# EAGLE schematic orbiphone (EAGLE 9.6.2)
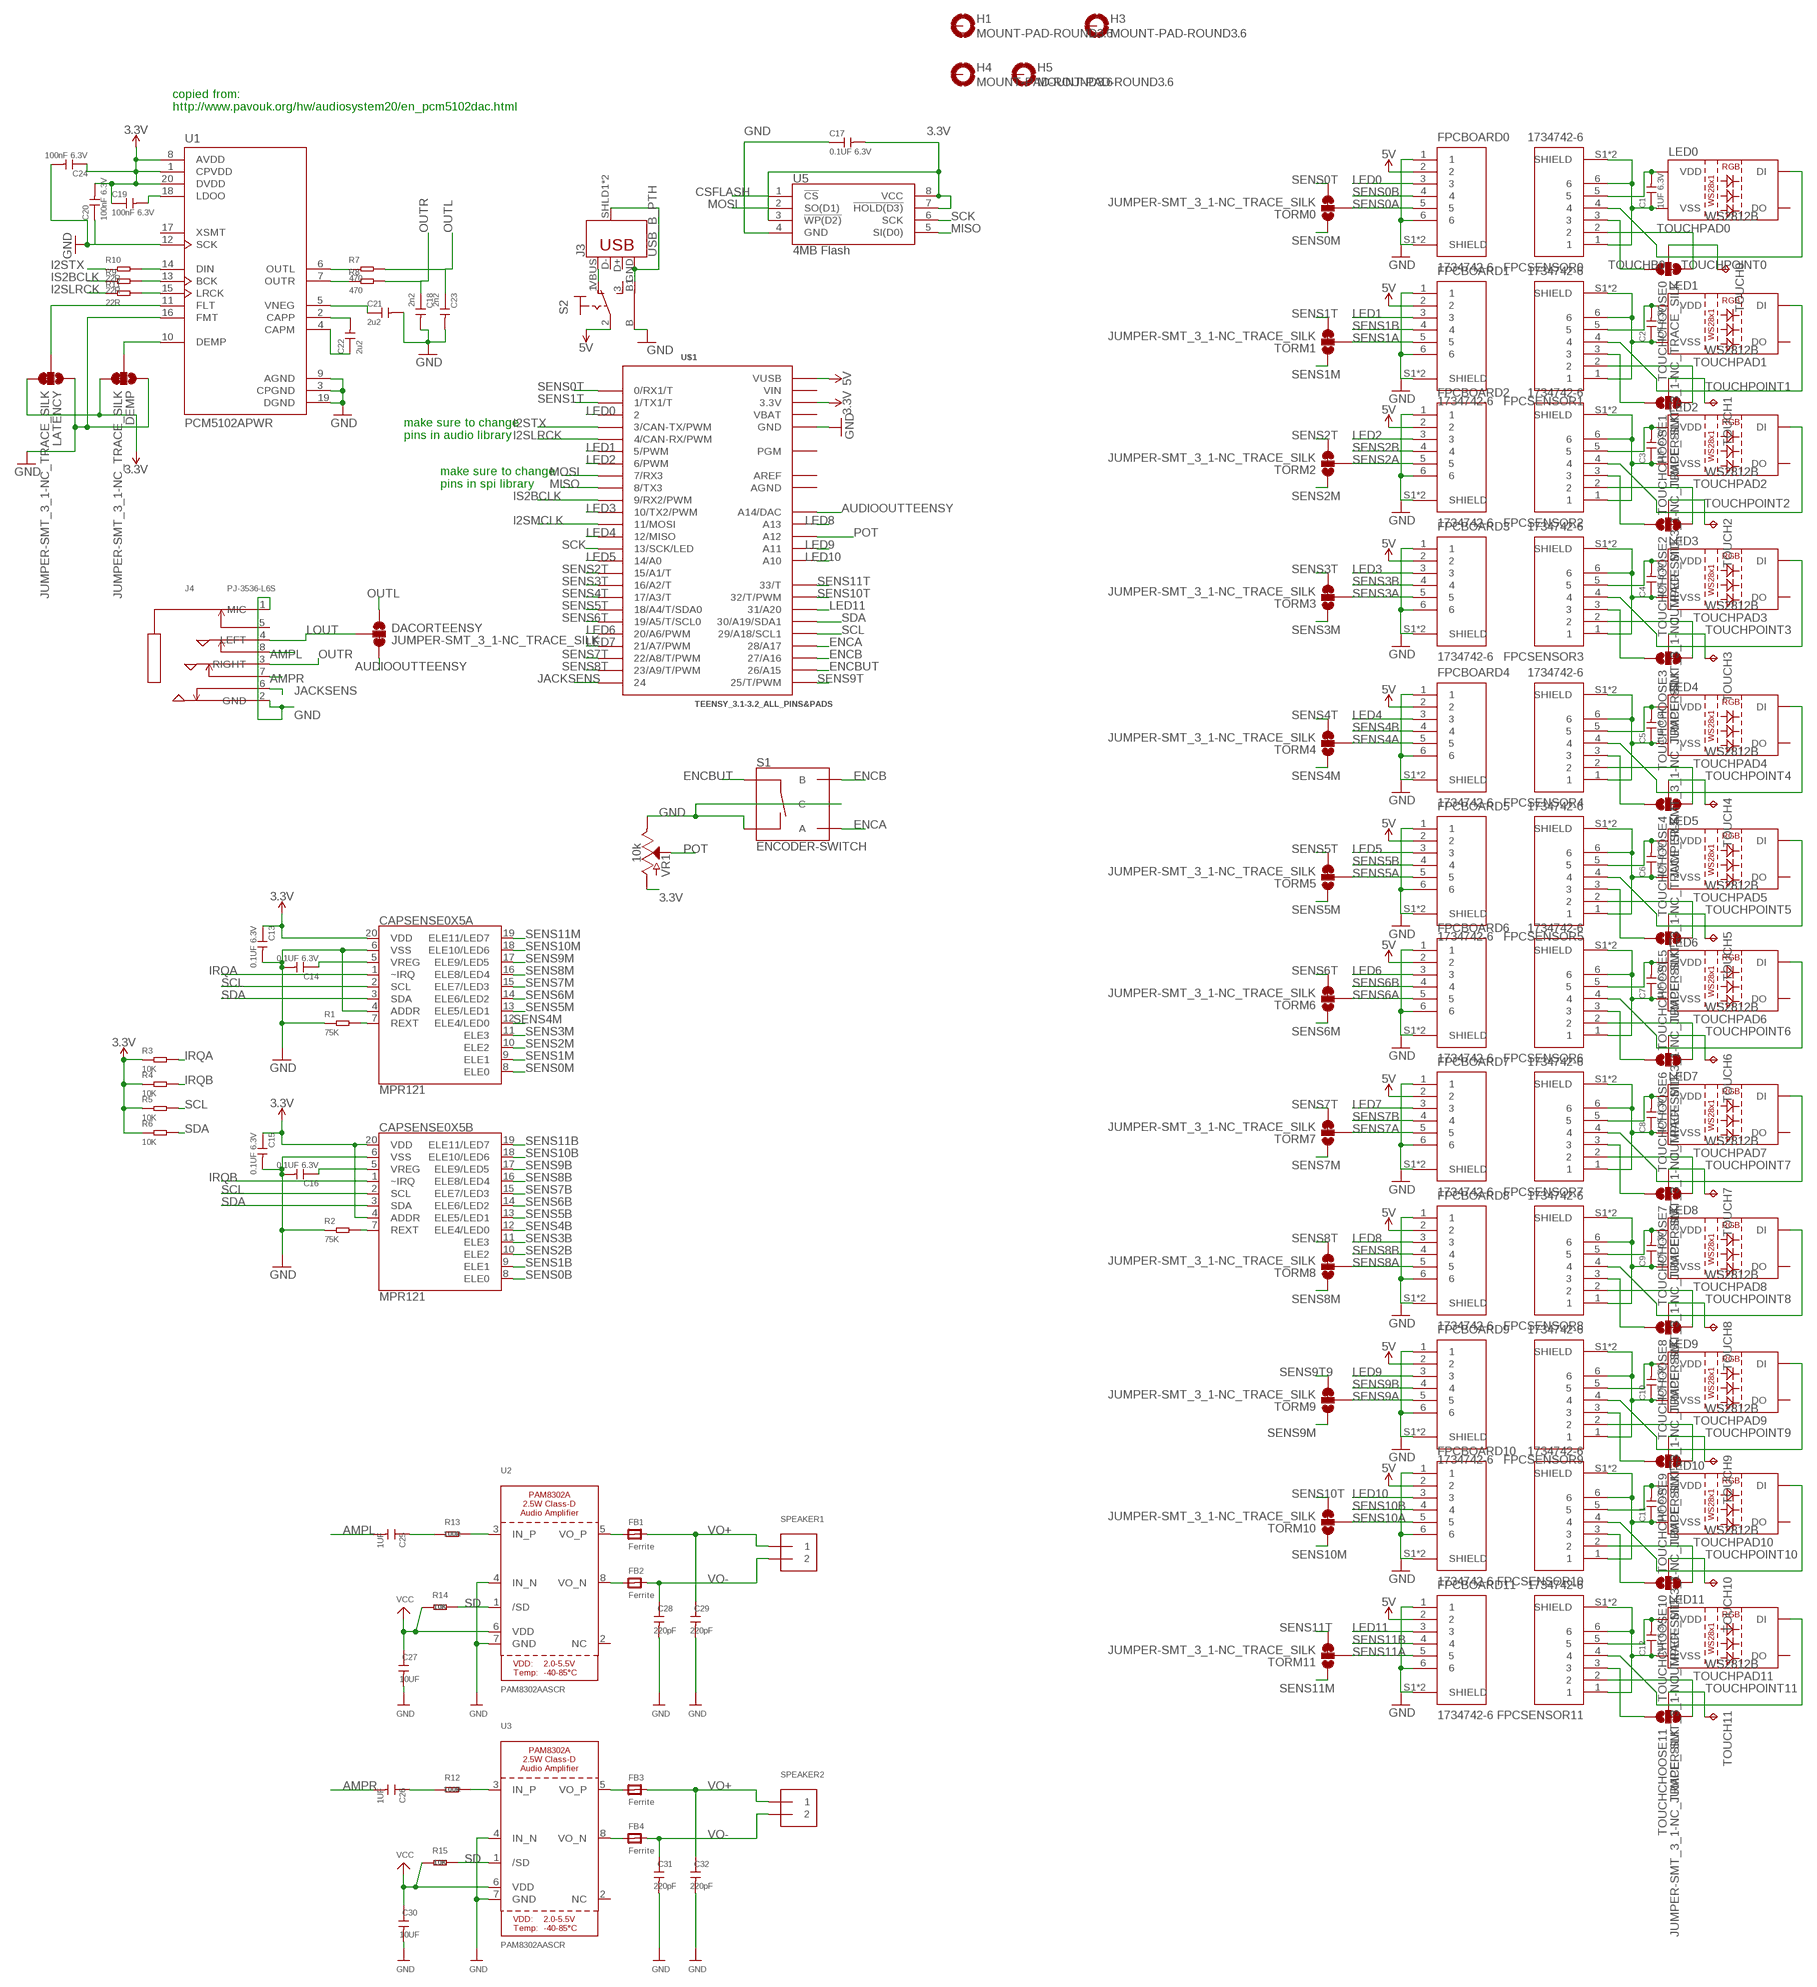
[diagram p0: schematic, sheet 1]

## Parts
C1  1UF 6.3V  CERAMIC-1UF-6.3V-10%-X5R(0402)  [C0402]
C2  1UF 6.3V  CERAMIC-1UF-6.3V-10%-X5R(0402)  [C0402]
C3  1UF 6.3V  CERAMIC-1UF-6.3V-10%-X5R(0402)  [C0402]
C4  1UF 6.3V  CERAMIC-1UF-6.3V-10%-X5R(0402)  [C0402]
C5  1UF 6.3V  CERAMIC-1UF-6.3V-10%-X5R(0402)  [C0402]
C6  1UF 6.3V  CERAMIC-1UF-6.3V-10%-X5R(0402)  [C0402]
C7  1UF 6.3V  CERAMIC-1UF-6.3V-10%-X5R(0402)  [C0402]
C8  1UF 6.3V  CERAMIC-1UF-6.3V-10%-X5R(0402)  [C0402]
C9  1UF 6.3V  CERAMIC-1UF-6.3V-10%-X5R(0402)  [C0402]
C10  1UF 6.3V  CERAMIC-1UF-6.3V-10%-X5R(0402)  [C0402]
C11  1UF 6.3V  CERAMIC-1UF-6.3V-10%-X5R(0402)  [C0402]
C12  1UF 6.3V  CERAMIC-1UF-6.3V-10%-X5R(0402)  [C0402]
C13  0.1UF 6.3V  CERAMIC-1UF-6.3V-10%-X5R(0402)  [C0402]
C14  0.1UF 6.3V  CERAMIC-1UF-6.3V-10%-X5R(0402)  [C0402]
C15  0.1UF 6.3V  CERAMIC-1UF-6.3V-10%-X5R(0402)  [C0402]
C16  0.1UF 6.3V  CERAMIC-1UF-6.3V-10%-X5R(0402)  [C0402]
C17  0.1UF 6.3V  CERAMIC-1UF-6.3V-10%-X5R(0402)  [C0402]
C18  2n2  CERAMIC-1UF-6.3V-10%-X5R(0402)  [C0402]
C19  100nF 6.3V  CERAMIC-1UF-6.3V-10%-X5R(0402)  [C0402]
C20  100nF 6.3V  CERAMIC-1UF-6.3V-10%-X5R(0402)  [C0402]
C21  2u2  CERAMIC-1UF-6.3V-10%-X5R(0402)  [C0402]
C22  2u2  CERAMIC-1UF-6.3V-10%-X5R(0402)  [C0402]
C23  2n2  CERAMIC-1UF-6.3V-10%-X5R(0402)  [C0402]
C24  100nF 6.3V  CERAMIC-1UF-6.3V-10%-X5R(0402)  [C0402]
C25  1UF  CERAMIC-1UF-6.3V-10%-X5R(0402)  [C0402]
C26  1UF  CERAMIC-1UF-6.3V-10%-X5R(0402)  [C0402]
C27  10UF  CERAMIC-1UF-6.3V-10%-X5R(0402)  [C0402]
C28  220pF  CERAMIC-1UF-6.3V-10%-X5R(0402)  [C0402]
C29  220pF  CERAMIC-1UF-6.3V-10%-X5R(0402)  [C0402]
C30  10UF  CERAMIC-1UF-6.3V-10%-X5R(0402)  [C0402]
C31  220pF  CERAMIC-1UF-6.3V-10%-X5R(0402)  [C0402]
C32  220pF  CERAMIC-1UF-6.3V-10%-X5R(0402)  [C0402]
CAPSENSE0X5A  MPR121  [QFN-20]
CAPSENSE0X5B  MPR121  [QFN-20]
DACORTEENSY  JUMPER-SMT_3_1-NC_TRACE_SILK  [SMT-JUMPER_3_1-NC_TRACE_SILK]
DEMP  JUMPER-SMT_3_1-NC_TRACE_SILK  [SMT-JUMPER_3_1-NC_TRACE_SILK]
FB1  Ferrite  FERRITE_0805  [_0805]
FB2  Ferrite  FERRITE_0805  [_0805]
FB3  Ferrite  FERRITE_0805  [_0805]
FB4  Ferrite  FERRITE_0805  [_0805]
FPCBOARD0  1734742-6  [TE_1734742-6]
FPCBOARD1  1734742-6  [TE_1734742-6]
FPCBOARD2  1734742-6  [TE_1734742-6]
FPCBOARD3  1734742-6  [TE_1734742-6]
FPCBOARD4  1734742-6  [TE_1734742-6]
FPCBOARD5  1734742-6  [TE_1734742-6]
FPCBOARD6  1734742-6  [TE_1734742-6]
FPCBOARD7  1734742-6  [TE_1734742-6]
FPCBOARD8  1734742-6  [TE_1734742-6]
FPCBOARD9  1734742-6  [TE_1734742-6]
FPCBOARD10  1734742-6  [TE_1734742-6]
FPCBOARD11  1734742-6  [TE_1734742-6]
FPCSENSOR0  1734742-6  [TE_1734742-6]
FPCSENSOR1  1734742-6  [TE_1734742-6]
FPCSENSOR2  1734742-6  [TE_1734742-6]
FPCSENSOR3  1734742-6  [TE_1734742-6]
FPCSENSOR4  1734742-6  [TE_1734742-6]
FPCSENSOR5  1734742-6  [TE_1734742-6]
FPCSENSOR6  1734742-6  [TE_1734742-6]
FPCSENSOR7  1734742-6  [TE_1734742-6]
FPCSENSOR8  1734742-6  [TE_1734742-6]
FPCSENSOR9  1734742-6  [TE_1734742-6]
FPCSENSOR10  1734742-6  [TE_1734742-6]
FPCSENSOR11  1734742-6  [TE_1734742-6]
H1  MOUNT-PAD-ROUND3.6  [3,6-PAD]
H3  MOUNT-PAD-ROUND3.6  [3,6-PAD]
H4  MOUNT-PAD-ROUND3.6  [3,6-PAD]
H5  MOUNT-PAD-ROUND3.6  [3,6-PAD]
J3  USB_B_PTH  [USB-B-PTH]
J4  PJ-3536-L6S  AUDIO-JACK-SMD-8P(PJ-3536-L6S)  [AUDIO8P-SMD-3.5-14.5X6X5MM]
LATENCY  JUMPER-SMT_3_1-NC_TRACE_SILK  [SMT-JUMPER_3_1-NC_TRACE_SILK]
LED0  WS2812B  [WS2812B]
LED1  WS2812B  [WS2812B]
LED2  WS2812B  [WS2812B]
LED3  WS2812B  [WS2812B]
LED4  WS2812B  [WS2812B]
LED5  WS2812B  [WS2812B]
LED6  WS2812B  [WS2812B]
LED7  WS2812B  [WS2812B]
LED8  WS2812B  [WS2812B]
LED9  WS2812B  [WS2812B]
LED10  WS2812B  [WS2812B]
LED11  WS2812B  [WS2812B]
R1  75K  SMD-RES-75K-1%-1/10W(0603)  [R0603]
R2  75K  SMD-RES-75K-1%-1/10W(0603)  [R0603]
R3  10K  SMD-RES-75K-1%-1/10W(0603)  [R0603]
R4  10K  SMD-RES-75K-1%-1/10W(0603)  [R0603]
R5  10K  SMD-RES-75K-1%-1/10W(0603)  [R0603]
R6  10K  SMD-RES-75K-1%-1/10W(0603)  [R0603]
R7  470  SMD-RES-75K-1%-1/10W(0603)  [R0603]
R8  470  SMD-RES-75K-1%-1/10W(0603)  [R0603]
R9  22R  SMD-RES-75K-1%-1/10W(0603)  [R0603]
R10  22R  SMD-RES-75K-1%-1/10W(0603)  [R0603]
R11  22R  SMD-RES-75K-1%-1/10W(0603)  [R0603]
R12  100R  SMD-RES-100R-1%-1/8W(0805)  [R0805]
R13  100R  SMD-RES-100R-1%-1/8W(0805)  [R0805]
R14  10K  SMD-RES-100R-1%-1/8W(0805)  [R0805]
R15  10K  SMD-RES-100R-1%-1/8W(0805)  [R0805]
S1  ENCODER-SWITCH  [ROTARY_ENC_PLAIN]
S2  316-917  [316-917]
SPEAKER1  TERMBLOCK_1X2  [TERMBLOCK_1X2-3.5MM]
SPEAKER2  TERMBLOCK_1X2  [TERMBLOCK_1X2-3.5MM]
TORM0  JUMPER-SMT_3_1-NC_TRACE_SILK  [SMT-JUMPER_3_1-NC_TRACE_SILK]
TORM1  JUMPER-SMT_3_1-NC_TRACE_SILK  [SMT-JUMPER_3_1-NC_TRACE_SILK]
TORM2  JUMPER-SMT_3_1-NC_TRACE_SILK  [SMT-JUMPER_3_1-NC_TRACE_SILK]
TORM3  JUMPER-SMT_3_1-NC_TRACE_SILK  [SMT-JUMPER_3_1-NC_TRACE_SILK]
TORM4  JUMPER-SMT_3_1-NC_TRACE_SILK  [SMT-JUMPER_3_1-NC_TRACE_SILK]
TORM5  JUMPER-SMT_3_1-NC_TRACE_SILK  [SMT-JUMPER_3_1-NC_TRACE_SILK]
TORM6  JUMPER-SMT_3_1-NC_TRACE_SILK  [SMT-JUMPER_3_1-NC_TRACE_SILK]
TORM7  JUMPER-SMT_3_1-NC_TRACE_SILK  [SMT-JUMPER_3_1-NC_TRACE_SILK]
TORM8  JUMPER-SMT_3_1-NC_TRACE_SILK  [SMT-JUMPER_3_1-NC_TRACE_SILK]
TORM9  JUMPER-SMT_3_1-NC_TRACE_SILK  [SMT-JUMPER_3_1-NC_TRACE_SILK]
TORM10  JUMPER-SMT_3_1-NC_TRACE_SILK  [SMT-JUMPER_3_1-NC_TRACE_SILK]
TORM11  JUMPER-SMT_3_1-NC_TRACE_SILK  [SMT-JUMPER_3_1-NC_TRACE_SILK]
TOUCH0  TPPAD1-13  [P1-13]
TOUCH1  TPPAD1-13  [P1-13]
TOUCH2  TPPAD1-13  [P1-13]
TOUCH3  TPPAD1-13  [P1-13]
TOUCH4  TPPAD1-13  [P1-13]
TOUCH5  TPPAD1-13  [P1-13]
TOUCH6  TPPAD1-13  [P1-13]
TOUCH7  TPPAD1-13  [P1-13]
TOUCH8  TPPAD1-13  [P1-13]
TOUCH9  TPPAD1-13  [P1-13]
TOUCH10  TPPAD1-13  [P1-13]
TOUCH11  TPPAD1-13  [P1-13]
TOUCHCHOOSE0  JUMPER-SMT_3_1-NC_TRACE_SILK  [SMT-JUMPER_3_1-NC_TRACE_SILK]
TOUCHCHOOSE1  JUMPER-SMT_3_1-NC_TRACE_SILK  [SMT-JUMPER_3_1-NC_TRACE_SILK]
TOUCHCHOOSE2  JUMPER-SMT_3_1-NC_TRACE_SILK  [SMT-JUMPER_3_1-NC_TRACE_SILK]
TOUCHCHOOSE3  JUMPER-SMT_3_1-NC_TRACE_SILK  [SMT-JUMPER_3_1-NC_TRACE_SILK]
TOUCHCHOOSE4  JUMPER-SMT_3_1-NC_TRACE_SILK  [SMT-JUMPER_3_1-NC_TRACE_SILK]
TOUCHCHOOSE5  JUMPER-SMT_3_1-NC_TRACE_SILK  [SMT-JUMPER_3_1-NC_TRACE_SILK]
TOUCHCHOOSE6  JUMPER-SMT_3_1-NC_TRACE_SILK  [SMT-JUMPER_3_1-NC_TRACE_SILK]
TOUCHCHOOSE7  JUMPER-SMT_3_1-NC_TRACE_SILK  [SMT-JUMPER_3_1-NC_TRACE_SILK]
TOUCHCHOOSE8  JUMPER-SMT_3_1-NC_TRACE_SILK  [SMT-JUMPER_3_1-NC_TRACE_SILK]
TOUCHCHOOSE9  JUMPER-SMT_3_1-NC_TRACE_SILK  [SMT-JUMPER_3_1-NC_TRACE_SILK]
TOUCHCHOOSE10  JUMPER-SMT_3_1-NC_TRACE_SILK  [SMT-JUMPER_3_1-NC_TRACE_SILK]
TOUCHCHOOSE11  JUMPER-SMT_3_1-NC_TRACE_SILK  [SMT-JUMPER_3_1-NC_TRACE_SILK]
U1  PCM5102APWR  [SOP65P640X120-20N]
U2  PAM8302AASCR  AUDIOAMP_PAM8302A  [MSOP8_0.65MM]
U3  PAM8302AASCR  AUDIOAMP_PAM8302A  [MSOP8_0.65MM]
U5  4MB Flash  AT25SF041  [SO08]
U$1  TEENSY_3.1-3.2_ALL_PINS&PADS  [TEENSY_3.0-3.2_ALL_PINS_&_PADS]
VR1  10k  POTENTIOMETER-PTH-9MM-1/20W-20%-KIT  [POT-PTH-ALPS-KIT]

## Nets
3.3V: C13.1 C15.1 C17.2 C19.1 C20.2 C24.1 CAPSENSE0X5A.20(VDD) CAPSENSE0X5B.4(ADDR) CAPSENSE0X5B.20(VDD) DEMP.3 LATENCY.3 R3.1 R4.1 R5.1 R6.1 U1.1(CPVDD) U1.8(AVDD) U1.20(DVDD) U5.3(!WP(D2)) U5.7(!HOLD(D3)) U5.8(VCC) U$1.3.3V U$1.3.3V1(3.3V) U$1.3.3V2(3.3V) VR1.P$3(A)
5V: FPCBOARD0.2 FPCBOARD1.2 FPCBOARD2.2 FPCBOARD3.2 FPCBOARD4.2 FPCBOARD5.2 FPCBOARD6.2 FPCBOARD7.2 FPCBOARD8.2 FPCBOARD9.2 FPCBOARD10.2 FPCBOARD11.2 S2.2(P) U$1.VUSB
AMPL: C25.2 J4.8
AMPR: C26.2 J4.7
AUDIOOUTTEENSY: DACORTEENSY.3 U$1.RESET/DAC(A14/DAC)
CSFLASH: U5.1(!CS)
ENCA: S1.A U$1.28(28/A17)
ENCB: S1.B U$1.27(27/A16)
ENCBUT: S1.SW+ U$1.26(26/A15)
GND: C13.2 C14.2 C15.2 C16.2 C17.1 C18.2 C20.1 C21.2 C23.2 C24.2 C27.2 C28.2 C29.2 C30.2 C31.2 C32.2 CAPSENSE0X5A.4(ADDR) CAPSENSE0X5A.6(VSS) CAPSENSE0X5B.6(VSS) DEMP.1 FPCBOARD0.1 FPCBOARD0.6 FPCBOARD0.S1(SHIELD) FPCBOARD0.S2(SHIELD) FPCBOARD1.1 FPCBOARD1.6 FPCBOARD1.S1(SHIELD) FPCBOARD1.S2(SHIELD) FPCBOARD2.1 FPCBOARD2.6 FPCBOARD2.S1(SHIELD) FPCBOARD2.S2(SHIELD) FPCBOARD3.1 FPCBOARD3.6 FPCBOARD3.S1(SHIELD) FPCBOARD3.S2(SHIELD) FPCBOARD4.1 FPCBOARD4.6 FPCBOARD4.S1(SHIELD) FPCBOARD4.S2(SHIELD) FPCBOARD5.1 FPCBOARD5.6 FPCBOARD5.S1(SHIELD) FPCBOARD5.S2(SHIELD) FPCBOARD6.1 FPCBOARD6.6 FPCBOARD6.S1(SHIELD) FPCBOARD6.S2(SHIELD) FPCBOARD7.1 FPCBOARD7.6 FPCBOARD7.S1(SHIELD) FPCBOARD7.S2(SHIELD) FPCBOARD8.1 FPCBOARD8.6 FPCBOARD8.S1(SHIELD) FPCBOARD8.S2(SHIELD) FPCBOARD9.1 FPCBOARD9.6 FPCBOARD9.S1(SHIELD) FPCBOARD9.S2(SHIELD) FPCBOARD10.1 FPCBOARD10.6 FPCBOARD10.S1(SHIELD) FPCBOARD10.S2(SHIELD) FPCBOARD11.1 FPCBOARD11.6 FPCBOARD11.S1(SHIELD) FPCBOARD11.S2(SHIELD) J4.1(MIC) J4.2(GND) LATENCY.1 R1.1 R2.1 S1.C S1.SW- S2.B U1.3(CPGND) U1.9(AGND) U1.12(SCK) U1.16(FMT) U1.19(DGND) U2.4(IN_N) U2.7(GND) U3.4(IN_N) U3.7(GND) U5.4(GND) U$1.GND U$1.GND1(GND) U$1.GND2(GND) VR1.P$1(E)
I2SLRCK: R11.1 U$1.4(4/CAN-RX/PWM)
I2SMCLK: U$1.11(11/MOSI)
I2STX: R10.1 U$1.3(3/CAN-TX/PWM)
IRQA: CAPSENSE0X5A.1(~IRQ) R3.2
IRQB: CAPSENSE0X5B.1(~IRQ) R4.2
IS2BCLK: R9.1 U$1.9(9/RX2/PWM)
JACKSENS: J4.6 U$1.24
LED0: FPCBOARD0.3 U$1.2
LED1: FPCBOARD1.3 U$1.5(5/PWM)
LED2: FPCBOARD2.3 U$1.6(6/PWM)
LED3: FPCBOARD3.3 U$1.10(10/TX2/PWM)
LED4: FPCBOARD4.3 U$1.12(12/MISO)
LED5: FPCBOARD5.3 U$1.14/A0
LED6: FPCBOARD6.3 U$1.20/A6(20/A6/PWM)
LED7: FPCBOARD7.3 U$1.21/A7(21/A7/PWM)
LED8: FPCBOARD8.3 U$1.A13
LED9: FPCBOARD9.3 U$1.A11
LED10: FPCBOARD10.3 U$1.A10
LED11: FPCBOARD11.3 U$1.31(31/A20)
LOUT: DACORTEENSY.2 J4.4(LEFT)
MISO: U5.5(SI(D0)) U$1.8(8/TX3)
MOSI: U5.2(SO(D1)) U$1.7(7/RX3)
N$1: C1.1 FPCSENSOR0.1 FPCSENSOR0.6 FPCSENSOR0.S1(SHIELD) FPCSENSOR0.S2(SHIELD) LED0.3(VSS)
N$2: C2.1 FPCSENSOR1.1 FPCSENSOR1.6 FPCSENSOR1.S1(SHIELD) FPCSENSOR1.S2(SHIELD) LED1.3(VSS)
N$3: C1.2 FPCSENSOR0.5 LED0.1(VDD)
N$4: FPCSENSOR0.4 LED0.4(DI)
N$5: C2.2 FPCSENSOR1.5 LED1.1(VDD)
N$6: FPCSENSOR1.4 LED1.4(DI)
N$9: FPCSENSOR1.3 TOUCHCHOOSE1.1
N$10: C3.1 FPCSENSOR2.1 FPCSENSOR2.6 FPCSENSOR2.S1(SHIELD) FPCSENSOR2.S2(SHIELD) LED2.3(VSS)
N$11: C3.2 FPCSENSOR2.5 LED2.1(VDD)
N$12: FPCSENSOR2.4 LED2.4(DI)
N$15: FPCSENSOR2.3 TOUCHCHOOSE2.1
N$16: C4.1 FPCSENSOR3.1 FPCSENSOR3.6 FPCSENSOR3.S1(SHIELD) FPCSENSOR3.S2(SHIELD) LED3.3(VSS)
N$17: C4.2 FPCSENSOR3.5 LED3.1(VDD)
N$18: FPCSENSOR3.4 LED3.4(DI)
N$21: FPCSENSOR3.3 TOUCHCHOOSE3.1
N$22: C5.1 FPCSENSOR4.1 FPCSENSOR4.6 FPCSENSOR4.S1(SHIELD) FPCSENSOR4.S2(SHIELD) LED4.3(VSS)
N$23: C5.2 FPCSENSOR4.5 LED4.1(VDD)
N$24: FPCSENSOR4.4 LED4.4(DI)
N$27: FPCSENSOR4.3 TOUCHCHOOSE4.1
N$28: C6.1 FPCSENSOR5.1 FPCSENSOR5.6 FPCSENSOR5.S1(SHIELD) FPCSENSOR5.S2(SHIELD) LED5.3(VSS)
N$29: C6.2 FPCSENSOR5.5 LED5.1(VDD)
N$30: FPCSENSOR5.4 LED5.4(DI)
N$33: FPCSENSOR5.3 TOUCHCHOOSE5.1
N$34: C7.1 FPCSENSOR6.1 FPCSENSOR6.6 FPCSENSOR6.S1(SHIELD) FPCSENSOR6.S2(SHIELD) LED6.3(VSS)
N$35: C7.2 FPCSENSOR6.5 LED6.1(VDD)
N$36: FPCSENSOR6.4 LED6.4(DI)
N$37: C14.1 CAPSENSE0X5A.5(VREG)
N$38: CAPSENSE0X5A.7(REXT) R1.2
N$42: J3.GND J3.SHLD1(SHIELD) J3.SHLD2(SHIELD) S2.B1
N$43: J3.VBUS S2.1(O)
N$53: C16.1 CAPSENSE0X5B.5(VREG)
N$54: CAPSENSE0X5B.7(REXT) R2.2
N$66: R10.2 U1.14(DIN)
N$67: R9.2 U1.13(BCK)
N$68: R11.2 U1.15(LRCK)
N$69: C19.2 U1.18(LDOO)
N$70: C22.2 U1.2(CAPP)
N$71: C22.1 U1.4(CAPM)
N$72: C21.1 U1.5(VNEG)
N$73: R7.1 U1.6(OUTL)
N$74: R8.1 U1.7(OUTR)
N$75: LATENCY.2 U1.11(FLT)
N$76: DEMP.2 U1.10(DEMP)
N$77: R12.2 U3.3(IN_P)
N$78: R13.2 U2.3(IN_P)
N$79: FB4.1 U3.8(VO_N)
N$80: FB2.1 U2.8(VO_N)
N$81: FB1.1 U2.5(VO_P)
N$82: C25.1 R13.1
N$83: FB3.1 U3.5(VO_P)
N$84: C26.1 R12.1
N$87: FPCSENSOR6.3 TOUCHCHOOSE6.1
N$88: C8.1 FPCSENSOR7.1 FPCSENSOR7.6 FPCSENSOR7.S1(SHIELD) FPCSENSOR7.S2(SHIELD) LED7.3(VSS)
N$89: C8.2 FPCSENSOR7.5 LED7.1(VDD)
N$90: FPCSENSOR7.4 LED7.4(DI)
N$93: FPCSENSOR7.3 TOUCHCHOOSE7.1
N$94: C9.1 FPCSENSOR8.1 FPCSENSOR8.6 FPCSENSOR8.S1(SHIELD) FPCSENSOR8.S2(SHIELD) LED8.3(VSS)
N$95: C9.2 FPCSENSOR8.5 LED8.1(VDD)
N$96: FPCSENSOR8.4 LED8.4(DI)
N$99: FPCSENSOR8.3 TOUCHCHOOSE8.1
N$100: C10.1 FPCSENSOR9.1 FPCSENSOR9.6 FPCSENSOR9.S1(SHIELD) FPCSENSOR9.S2(SHIELD) LED9.3(VSS)
N$101: C10.2 FPCSENSOR9.5 LED9.1(VDD)
N$102: FPCSENSOR9.4 LED9.4(DI)
N$105: FPCSENSOR9.3 TOUCHCHOOSE9.1
N$106: C11.1 FPCSENSOR10.1 FPCSENSOR10.6 FPCSENSOR10.S1(SHIELD) FPCSENSOR10.S2(SHIELD) LED10.3(VSS)
N$107: C11.2 FPCSENSOR10.5 LED10.1(VDD)
N$108: FPCSENSOR10.4 LED10.4(DI)
N$111: FPCSENSOR10.3 TOUCHCHOOSE10.1
N$112: C12.1 FPCSENSOR11.1 FPCSENSOR11.6 FPCSENSOR11.S1(SHIELD) FPCSENSOR11.S2(SHIELD) LED11.3(VSS)
N$113: C12.2 FPCSENSOR11.5 LED11.1(VDD)
N$114: FPCSENSOR11.4 LED11.4(DI)
N$117: FPCSENSOR11.3 TOUCHCHOOSE11.1
OUTL: C23.1 DACORTEENSY.1 R7.2
OUTR: C18.1 J4.3(RIGHT) R8.2
POT: U$1.A12 VR1.P$2(S)
SCK: U5.6(SCK) U$1.13(13/SCK/LED)
SCL: CAPSENSE0X5A.2(SCL) CAPSENSE0X5B.2(SCL) R5.2 U$1.29(29/A18/SCL1)
SD: R14.2 R15.2 U2.1(/SD) U3.1(/SD)
SDA: CAPSENSE0X5A.3(SDA) CAPSENSE0X5B.3(SDA) R6.2 U$1.30(30/A19/SDA1)
SENS0A: FPCBOARD0.5 TORM0.2
SENS0B: CAPSENSE0X5B.8(ELE0) FPCBOARD0.4
SENS0M: CAPSENSE0X5A.8(ELE0) TORM0.1
SENS0T: TORM0.3 U$1.0(0/RX1/T)
SENS1A: FPCBOARD1.5 TORM1.2
SENS1B: CAPSENSE0X5B.9(ELE1) FPCBOARD1.4
SENS1M: CAPSENSE0X5A.9(ELE1) TORM1.1
SENS1T: TORM1.3 U$1.1(1/TX1/T)
SENS2A: FPCBOARD2.5 TORM2.2
SENS2B: CAPSENSE0X5B.10(ELE2) FPCBOARD2.4
SENS2M: CAPSENSE0X5A.10(ELE2) TORM2.1
SENS2T: TORM2.3 U$1.15/A1(15/A1/T)
SENS3A: FPCBOARD3.5 TORM3.2
SENS3B: CAPSENSE0X5B.11(ELE3) FPCBOARD3.4
SENS3M: CAPSENSE0X5A.11(ELE3) TORM3.1
SENS3T: TORM3.3 U$1.16/A2(16/A2/T)
SENS4A: FPCBOARD4.5 TORM4.2
SENS4B: CAPSENSE0X5B.12(ELE4/LED0) FPCBOARD4.4
SENS4M: CAPSENSE0X5A.12(ELE4/LED0) TORM4.1
SENS4T: TORM4.3 U$1.17/A3(17/A3/T)
SENS5A: FPCBOARD5.5 TORM5.2
SENS5B: CAPSENSE0X5B.13(ELE5/LED1) FPCBOARD5.4
SENS5M: CAPSENSE0X5A.13(ELE5/LED1) TORM5.1
SENS5T: TORM5.3 U$1.18/A4(18/A4/T/SDA0)
SENS6A: FPCBOARD6.5 TORM6.2
SENS6B: CAPSENSE0X5B.14(ELE6/LED2) FPCBOARD6.4
SENS6M: CAPSENSE0X5A.14(ELE6/LED2) TORM6.1
SENS6T: TORM6.3 U$1.19/A5(19/A5/T/SCL0)
SENS7A: FPCBOARD7.5 TORM7.2
SENS7B: CAPSENSE0X5B.15(ELE7/LED3) FPCBOARD7.4
SENS7M: CAPSENSE0X5A.15(ELE7/LED3) TORM7.1
SENS7T: TORM7.3 U$1.22/A8(22/A8/T/PWM)
SENS8A: FPCBOARD8.5 TORM8.2
SENS8B: CAPSENSE0X5B.16(ELE8/LED4) FPCBOARD8.4
SENS8M: CAPSENSE0X5A.16(ELE8/LED4) TORM8.1
SENS8T: TORM8.3 U$1.23/A9(23/A9/T/PWM)
SENS9A: FPCBOARD9.5 TORM9.2
SENS9B: CAPSENSE0X5B.17(ELE9/LED5) FPCBOARD9.4
SENS9M: CAPSENSE0X5A.17(ELE9/LED5) TORM9.1
SENS9T: U$1.25(25/T/PWM)
SENS9T9: TORM9.3
SENS10A: FPCBOARD10.5 TORM10.2
SENS10B: CAPSENSE0X5B.18(ELE10/LED6) FPCBOARD10.4
SENS10M: CAPSENSE0X5A.18(ELE10/LED6) TORM10.1
SENS10T: TORM10.3 U$1.32(32/T/PWM)
SENS11A: FPCBOARD11.5 TORM11.2
SENS11B: CAPSENSE0X5B.19(ELE11/LED7) FPCBOARD11.4
SENS11M: CAPSENSE0X5A.19(ELE11/LED7) TORM11.1
SENS11T: TORM11.3 U$1.33(33/T)
TOUCHB0: FPCSENSOR0.3 TOUCHCHOOSE0.1
TOUCHPAD0: FPCSENSOR0.2 TOUCHCHOOSE0.3
TOUCHPAD1: FPCSENSOR1.2 TOUCHCHOOSE1.3
TOUCHPAD2: FPCSENSOR2.2 TOUCHCHOOSE2.3
TOUCHPAD3: FPCSENSOR3.2 TOUCHCHOOSE3.3
TOUCHPAD4: FPCSENSOR4.2 TOUCHCHOOSE4.3
TOUCHPAD5: FPCSENSOR5.2 TOUCHCHOOSE5.3
TOUCHPAD6: FPCSENSOR6.2 TOUCHCHOOSE6.3
TOUCHPAD7: FPCSENSOR7.2 TOUCHCHOOSE7.3
TOUCHPAD8: FPCSENSOR8.2 TOUCHCHOOSE8.3
TOUCHPAD9: FPCSENSOR9.2 TOUCHCHOOSE9.3
TOUCHPAD10: FPCSENSOR10.2 TOUCHCHOOSE10.3
TOUCHPAD11: FPCSENSOR11.2 TOUCHCHOOSE11.3
TOUCHPOINT0: TOUCH0.TP TOUCHCHOOSE0.2
TOUCHPOINT1: TOUCH1.TP TOUCHCHOOSE1.2
TOUCHPOINT2: TOUCH2.TP TOUCHCHOOSE2.2
TOUCHPOINT3: TOUCH3.TP TOUCHCHOOSE3.2
TOUCHPOINT4: TOUCH4.TP TOUCHCHOOSE4.2
TOUCHPOINT5: TOUCH5.TP TOUCHCHOOSE5.2
TOUCHPOINT6: TOUCH6.TP TOUCHCHOOSE6.2
TOUCHPOINT7: TOUCH7.TP TOUCHCHOOSE7.2
TOUCHPOINT8: TOUCH8.TP TOUCHCHOOSE8.2
TOUCHPOINT9: TOUCH9.TP TOUCHCHOOSE9.2
TOUCHPOINT10: TOUCH10.TP TOUCHCHOOSE10.2
TOUCHPOINT11: TOUCH11.TP TOUCHCHOOSE11.2
VCC: C27.1 C30.1 R14.1 R15.1 U2.6(VDD) U3.6(VDD)
VO+: C29.1 C32.1 FB1.2 FB3.2 SPEAKER1.1 SPEAKER2.1
VO-: C28.1 C31.1 FB2.2 FB4.2 SPEAKER1.2 SPEAKER2.2
Unconnected: H1.B3,6(MOUNT) H3.B3,6(MOUNT) H4.B3,6(MOUNT) H5.B3,6(MOUNT) J3.D+ J3.D- J4.5 LED0.2(DO) LED1.2(DO) LED2.2(DO) LED3.2(DO) LED4.2(DO) LED5.2(DO) LED6.2(DO) LED7.2(DO) LED8.2(DO) LED9.2(DO) LED10.2(DO) LED11.2(DO) S2.3(S) U1.17(XSMT) U2.2(NC) U3.2(NC) U$1.PGM

## Notes on the sheet
- copied from:
  http://www.pavouk.org/hw/audiosystem20/en_pcm5102dac.html
- make sure to change
  pins in audio library
- make sure to change
  pins in spi library

## Power pins joined to a net without a drawn wire
AGND: U$1.AGND
AREF: U$1.AREF
VBAT: U$1.VBAT
VIN: U$1.VIN

## Library data of the parts
C1-C12 = OPL_Capacitor:CERAMIC-1UF-6.3V-10%-X5R(0402): 302010003; MPN: CC0402KRX5R5BB105
C13-C32 = OPL_Capacitor:CERAMIC-1UF-6.3V-10%-X5R(0402): 302010003; MPN: CC0402KRX5R5BB105; VALUE: 1UF 6.3V
CAPSENSE0X5A CAPSENSE0X5B = SparkFun-Sensors:MPR121: NXP MPR121 Proximity Capacitive Touch Sensor Controller The MPR121 is a capacitive touch sensor controller driven by an I2C interface. The chip can control up to twelve individual electrodes, as well as a simulated thirteenth electrode. The MPR121 also features eight LED driving pins. When these pins are not configured as electrodes, they may be used to drive LEDs. Datasheet <http://www.sparkfun.com/datasheets/Components/MPR121.pdf> SparkFun Products Capacitive Touch Sensor Controller - MPR121QR2 <https://www.sparkfun.com/products/9604> (COM-09604) SparkFun Capacitive Touch Sensor Breakout - MPR121 <https://www.sparkfun.com/products/9695> (SEN-09695) SparkFun Touch Shield <https://www.sparkfun.com/products/12013> (DEV-12013) SparkFun Capacitive Touch Keypad - MPR121 <https://www.sparkfun.com/products/12017> (SEN-12017); PROD_ID: IC-09490; SF_ID: COM-09604
DACORTEENSY DEMP LATENCY TORM0 TORM1-TORM11 TOUCHCHOOSE0 TOUCHCHOOSE1-TOUCHCHOOSE11 = SparkFun-Jumpers:JUMPER-SMT_3_1-NC_TRACE: Normally closed trace jumper (1 of 2 connections) This jumper has a trace between two pads so it's normally closed (NC). The other connection is normally open (NO). Use a razor knife to open the connection. For best results follow the IPC guidelines for cutting traces: Cutout at least 0.063 mm (0.005 in). Remove all loose material to clean up the cut area. Seal the cut with an approved epoxy. Reapply solder to reclose the connection, or to close the NO connection.
FB1-FB4 = microbuilder:FERRITE: Ferrite Bead 0603 MMZ1608B121C - 120 Ohm @ 100MHz, 600mA, 0.15 Ohm DC Resistance - Digikey: 445-2164-1-ND BK1608HW121-T - 120 Ohm, 600mA Ferrite Chip - Digikey: 587-1876-2-ND 0805 HZ0805B272R-10 - 2.7K Ohm @ 100MHz, 200mA, 0.8 Ohm DC Resistance - Digikey: 240-2504-1-ND (see also Murata BLM21BD272SN1L) MMZ2012Y152B - 1.5K Ohm @ 100MHz, 500mA, 0.4 Ohm DC Resistance - Digikey: 445-1560-1-ND - Mainly for high frequency (80-400MHz) MMZ2012R102A - 1K Ohm @ 100MHz, 500mA, 0.3 Ohm DC Resistance - Digikey: 445-1555-2-ND - More general purpose (10-200MHz)
FPCBOARD0 FPCBOARD1-FPCBOARD11 FPCSENSOR0 FPCSENSOR1-FPCSENSOR11 = 1734742-6:1734742-6: Check prices <https://snapeda.com/parts/1734742-6/TE%20Connectivity/view-part/?ref=eda>; AVAILABILITY: Warning; COMMENT: 1734742-6; DESCRIPTION: Conn FPC Connector SKT 6 POS 0.5mm Solder ST SMD T/R; DIGIKEY-PURCHASE-URL: https://snapeda.com/shop?store=DigiKey&id=501394; EU_ROHS_COMPLIANCE: Compliant; MF: TE Connectivity; MOUSER-PURCHASE-URL: https://snapeda.com/shop?store=Mouser&id=501394; MP: 1734742-6; PACKAGE: None; PRICE: None
H1 H3-H5 = holes:MOUNT-PAD-ROUND: MOUNTING PAD, round
J3 = SparkFun-Connectors:USB_B: USB Type B Connector SparkFun Products: SparkFun Stepoko <https://www.sparkfun.com/products/13899> PTH; PROD_ID: CONN-08278; SF_ID: PRT-00139
J4 = OPL_Connector:AUDIO-JACK-SMD-8P(PJ-3536-L6S): Seeed SKU 320040003 - SMD Audio Jack 3.5mm 4 Degree MPN: PJ-3536-L6S Important Notes: This part has an overhanging portion. The edge of the PCB should be aligned with the line marked PCB Edge to be mounted correctly. Seeed Fusion PCBA OPL <https://www.seeedstudio.com/opl.html> Order PCB/PCBA Now <https://www.seeedstudio.com/fusion_pcb.html> www.seeedstudio.com; MPN: PJ-3536-L6S
LED0 LED1-LED11 = SparkFun-LED:WS2812B: WS2812B SMD addressable RGB LED 5x5mm SMD LED with built-in controller IC. Color: Red/Green/Blue mC Rating: RGB: 390, 660, 180 mcd Forward Voltage: RGB: 2.0, 3.0, 3.0 V Packages:WS2812B SparkFun Products: Blynk Board - ESP8266 <https://www.sparkfun.com/products/13794>; PROD_ID: DIO-12503
R1-R11 = OPL_Resistor:SMD-RES-75K-1%-1/10W(0603): 301012096; MPN: RC0603FR-071K5L; VALUE: 1.5K
R12-R15 = OPL_Resistor:SMD-RES-100R-1%-1/8W(0805): 301012151; MPN: RC0805JR-071KL; VALUE: 1K
S1 = SparkFun-Switches:ENCODER-SWITCH: Rotary Encoder w/ Select Switch Encoders rotate similarly to potentiometers, but they’re different from potentiometers in that an encoder has full rotation without limits. They output gray code so that you can tell how much and in which direction the encoder has been turned. This encoder includes a push-down select switch built into the shaft. SparkFun Products Rotary Encoder <https://www.sparkfun.com/products/9117> (COM-09117); SF_SKU: COM-09117
S2 = switch:316-917: TOGGLE SWITCH Mors, distributor RS Components
SPEAKER1 SPEAKER2 = microbuilder:TERMBLOCK_1X2: 3.5mm Terminal block http://www.ladyada.net/library/pcb/eaglelibrary.html
TOUCH0 TOUCH1-TOUCH11 = testpad:TP: Test pad
U1 = PCM5102APWR:PCM5102APWR: 2VRMS DirectPath, 112dB Audio Stereo DAC with 32-bit, 384kHz PCM Interface 20-TSSOP -25 to 85 Check prices <https://snapeda.com/parts/PCM5102APWR/Texas%20Instruments/view-part/?ref=eda>; ARROW_ASIA-PURCHASE-URL: https://snapeda.com/shop?store=Arrow+Asia&id=380885; AVAILABILITY: Warning; DESCRIPTION: 2VRMS DirectPath&trade;, 112dB Audio Stereo DAC with 32-bit, 384kHz PCM Interface 20-TSSOP -25 to 85; MF: Texas Instruments; MOUSER-PURCHASE-URL: https://snapeda.com/shop?store=Mouser&id=380885; MP: PCM5102APWR; PACKAGE: TSSOP-20 Texas Instruments; PRICE: None; TEXAS_INSTRUMENTS-PURCHASE-URL: https://snapeda.com/shop?store=Texas+Instruments&id=380885
U2 U3 = microbuilder:AUDIOAMP_PAM8302A: PAM8302A - 2.5W Class-D Mono Audio Amplifier MSOP8 = PAM8302AASCR
U5 = SparkFun-IC-Memory:AT25SF041: AT25SF041 4Mb Serial Flash Memory 104MHz, SPI, 8-SOIC Datasheet <http://www.adestotech.com/wp-content/uploads/DS-AT25SF041_044.pdf> SparkFun Products: SparkFun ESP8266 Thing <https://www.sparkfun.com/products/13231> SparkFun ESP8266 Thing - Dev Board <https://www.sparkfun.com/products/13711>; PROD_ID: IC-12455
U$1 = Teensy_3_and_LC_Series_Boards_v1.4:TEENSY_3.1-3.2_ALL_PINS&PADS: Footprint for Teensy 3.1 or 3.2 board using all pads and all through-holes. Pads need a 2x7 0.1" SMD header.
VR1 = SparkFun-Resistors:POTENTIOMETER: Potentiometer (Pot) Three-terminal potentiometers, with an adjustable wiper and two adjustable resistors. A pot can be used to create a configurable voltage divider, or as a variable resistor. Variants ALPS_POT and ALPS_POT_KIT - PTH, breadboard compatible, 9mm square pots Rotary Potentiometer - Linear (10k ohm) <https://www.sparkfun.com/products/9288> (COM-09288) The KIT variant exposes copper on only one side of the PTH pad, so the part can only be assembled on one side of the PCB. Useful for beginner soldering kits.; PROD_ID: RES-09177; SF_SKU: COM-09288